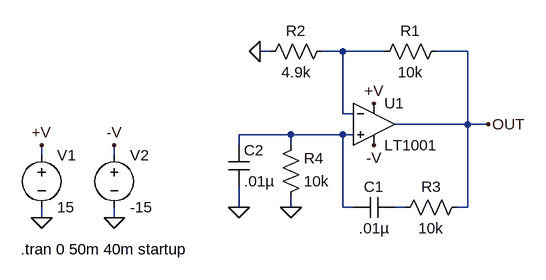
[diagram p0: schematic wien-without-agc.asc]
wien-without-agc.asc, the LTspice schematic file:
Version 4
SHEET 1 880 1108
WIRE 0 128 -16 128
WIRE 112 128 80 128
WIRE 176 128 112 128
WIRE 304 128 256 128
WIRE 112 224 112 128
WIRE 128 224 112 224
WIRE 304 240 304 128
WIRE 304 240 192 240
WIRE 336 240 304 240
WIRE 32 256 -48 256
WIRE 112 256 32 256
WIRE 128 256 112 256
WIRE -48 272 -48 256
WIRE 32 272 32 256
WIRE -352 288 -352 272
WIRE -240 288 -240 272
WIRE -48 368 -48 336
WIRE 32 368 32 352
WIRE 112 368 112 256
WIRE 128 368 112 368
WIRE 208 368 192 368
WIRE 304 368 304 240
WIRE 304 368 288 368
WIRE -352 384 -352 368
WIRE -240 384 -240 368
FLAG 160 208 +V
FLAG 160 272 -V
FLAG -352 272 +V
FLAG -240 384 0
FLAG -352 384 0
FLAG -240 272 -V
FLAG 32 368 0
FLAG -48 368 0
FLAG -16 128 0
FLAG 336 240 OUT
SYMBOL voltage -352 272 R0
SYMATTR InstName V1
SYMATTR Value 15
SYMBOL voltage -240 272 R0
SYMATTR InstName V2
SYMATTR Value -15
SYMBOL res 272 112 R90
WINDOW 0 0 56 VBottom 2
WINDOW 3 32 56 VTop 2
SYMATTR InstName R1
SYMATTR Value 10k
SYMBOL res 96 112 R90
WINDOW 0 0 56 VBottom 2
WINDOW 3 32 56 VTop 2
SYMATTR InstName R2
SYMATTR Value 4.9k
SYMBOL res 304 352 R90
WINDOW 0 0 56 VBottom 2
WINDOW 3 32 56 VTop 2
SYMATTR InstName R3
SYMATTR Value 10k
SYMBOL res 16 368 M180
WINDOW 0 36 76 Left 2
WINDOW 3 36 40 Left 2
SYMATTR InstName R4
SYMATTR Value 10k
SYMBOL cap 192 352 R90
WINDOW 0 0 32 VBottom 2
WINDOW 3 32 32 VTop 2
SYMATTR InstName C1
SYMATTR Value .01µ
SYMBOL cap -64 272 R0
SYMATTR InstName C2
SYMATTR Value .01µ
SYMBOL opamps\\LT1001 160 176 R0
SYMATTR InstName U1
TEXT -384 432 Left 2 !.tran 0 50m 40m startup

The netlist it stands for:
* wien-without-agc.asc
V1 +V 0 15
V2 -V 0 -15
R1 OUT N001 10k
R2 N001 0 4.9k
R3 OUT N003 10k
R4 0 N002 10k
C1 N003 N002 .01µ
C2 N002 0 .01µ
XU1 N002 N001 +V -V OUT LT1001  ; pins In+ In- V+ V- OUT
.tran 0 50m 40m startup
.lib LTC.lib
.backanno
.end